# Altium project FOC_V1.1.PrjPCB
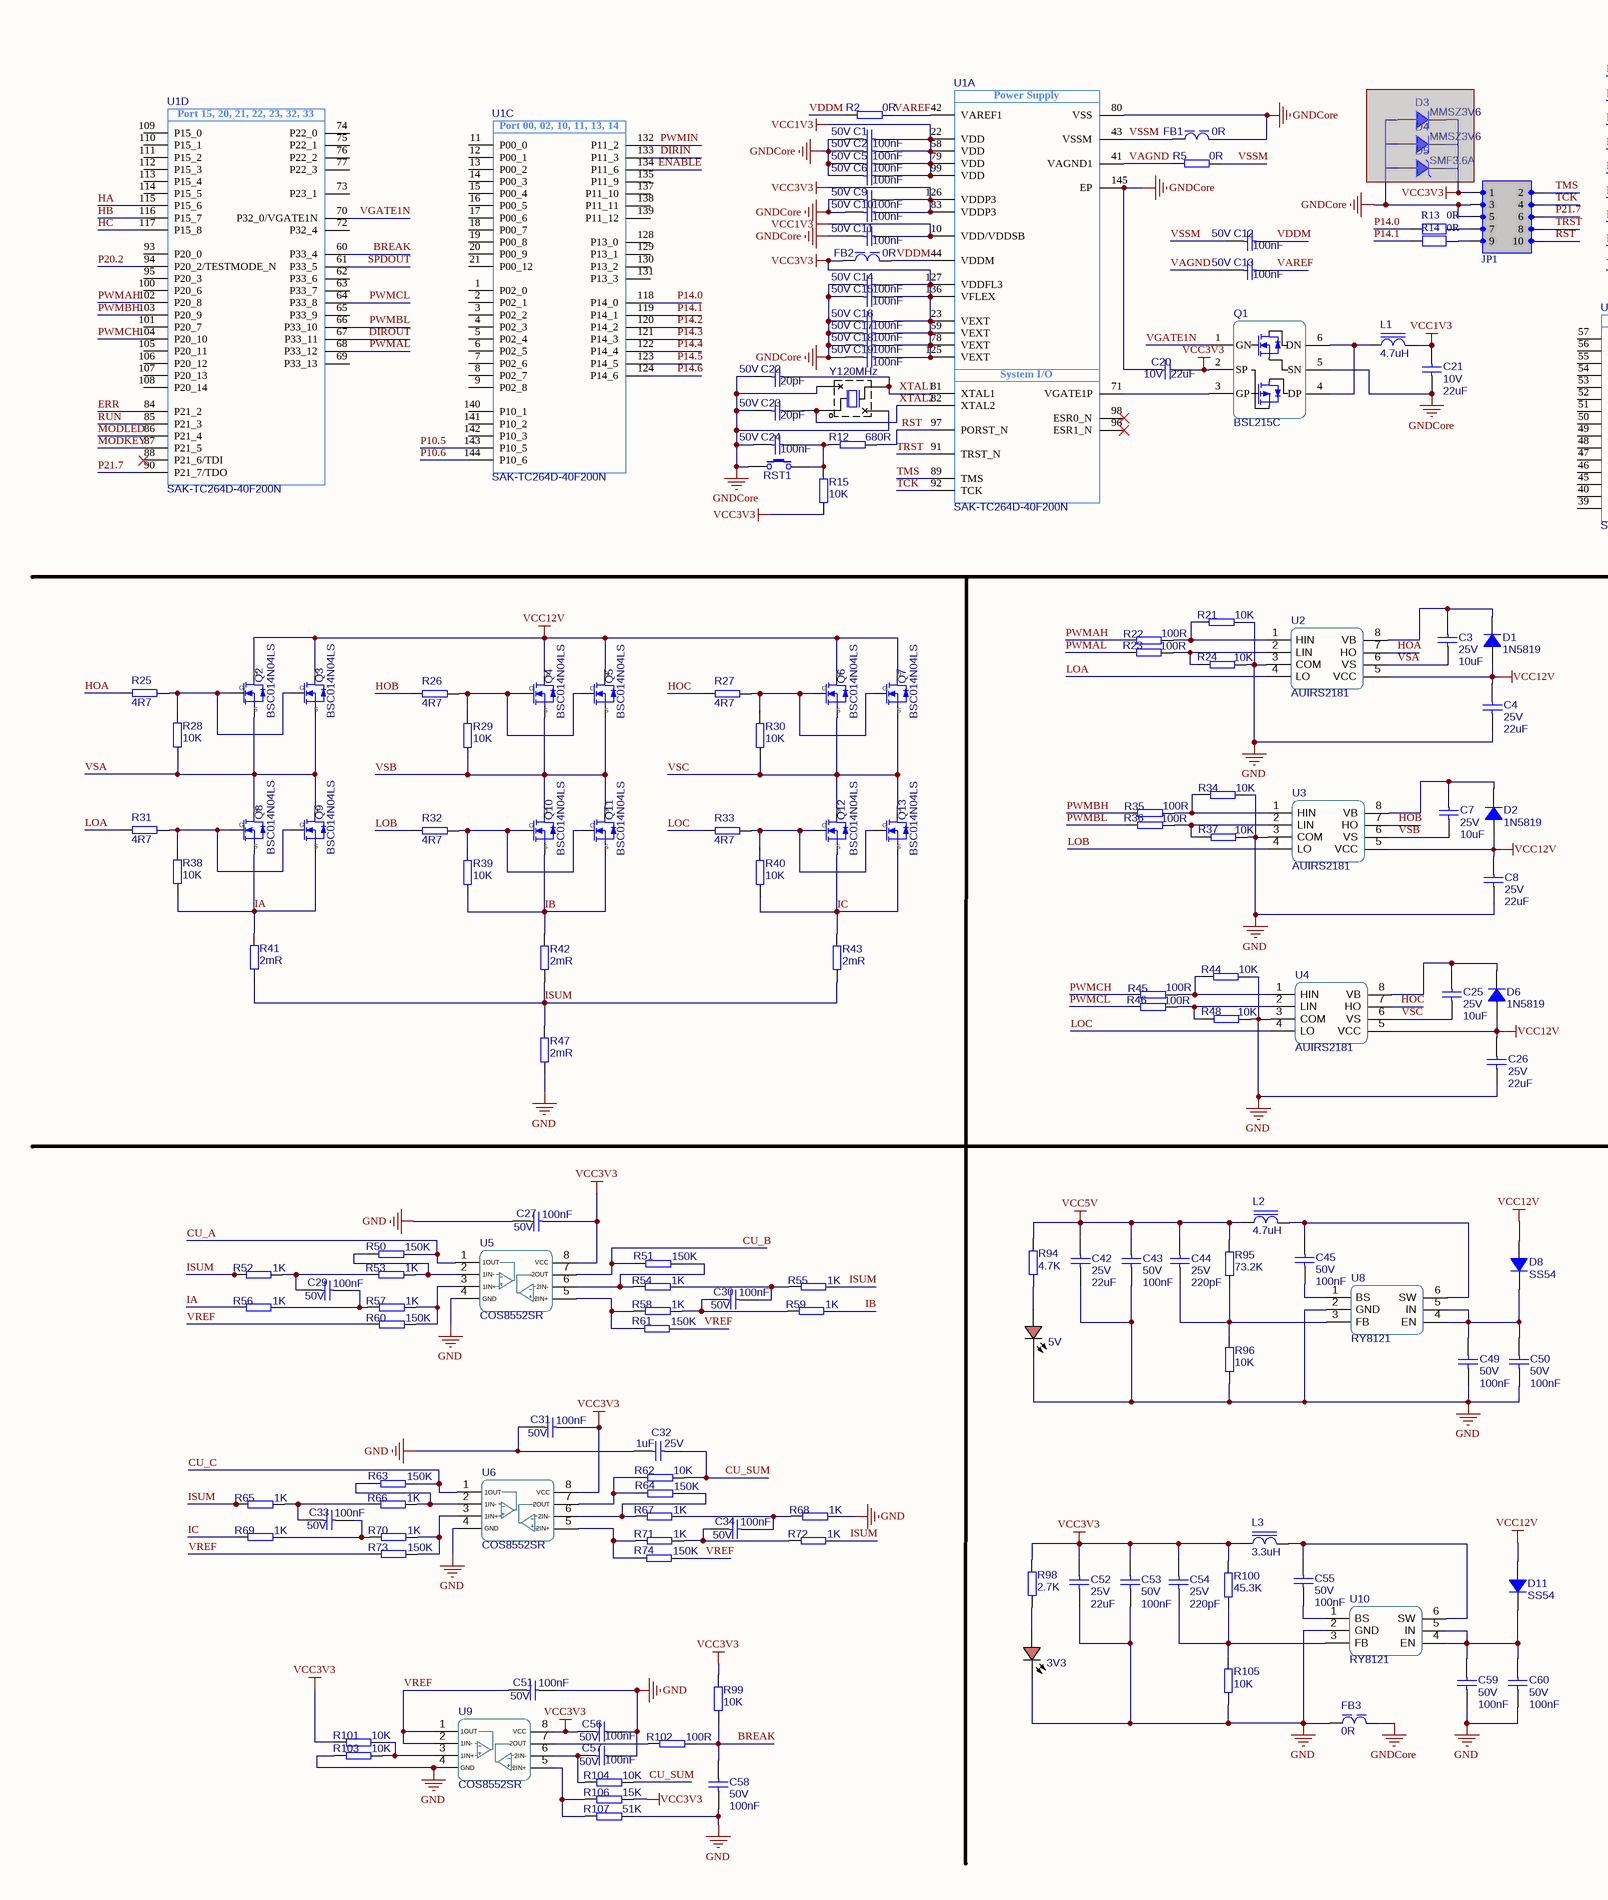
[diagram p0: Port.SchDoc, left]
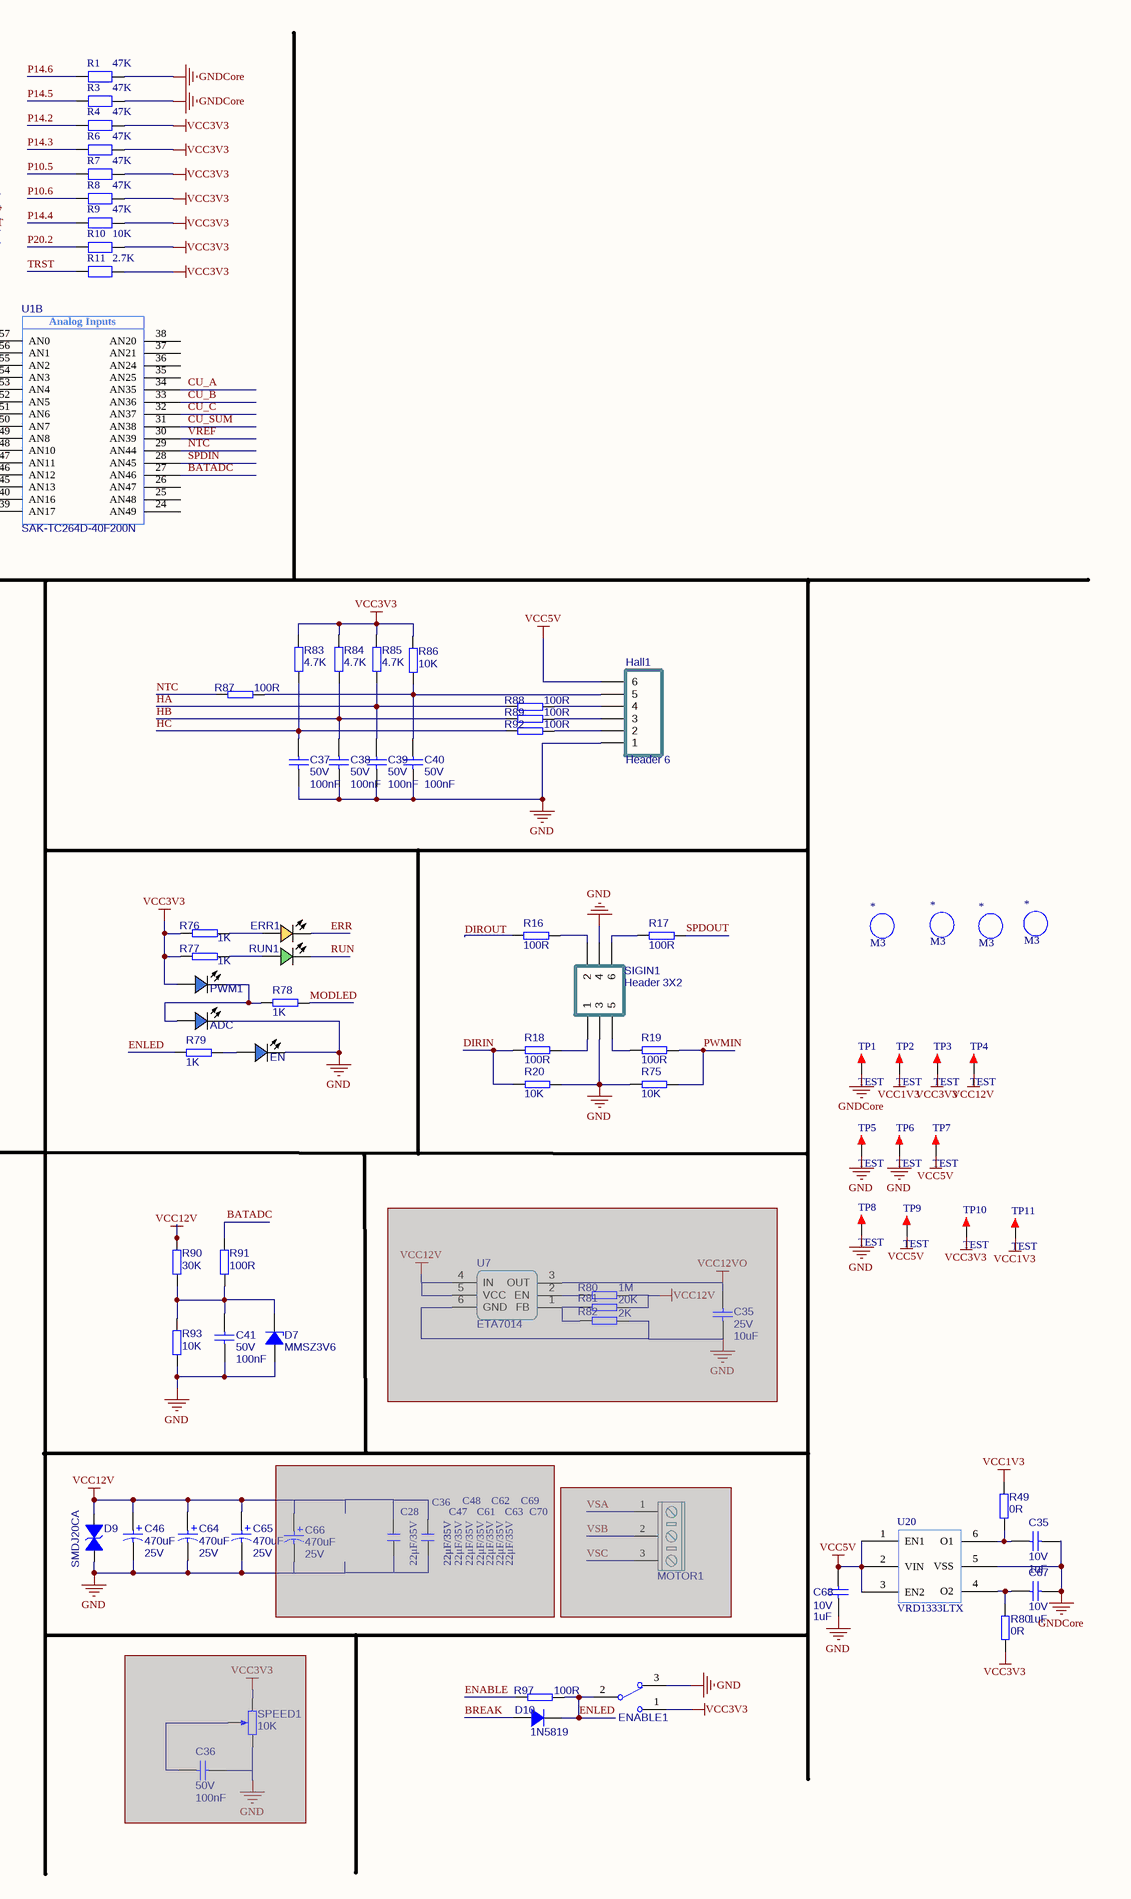
[diagram p1: Port.SchDoc, right]
1 sheet, 251 parts. Net scope: global (net labels, ports and power ports of the same name join across sheets).
Board files: FOC_V1.1.PcbDoc, INFILING.PcbDoc

## Sheet Port.SchDoc
size A2

### Parts
(Parts that share a designator on the sheet are numbered #1, #2 ... from top to bottom, then left to right.)
3V3  红色贴片LED  [LEDC1608(0603)-L]  (value not drawn)
5V  红色贴片LED  [LEDC1608(0603)-L]  (value not drawn)
*#1  M3  [M3 125X200]
*#2  M3  [M3 125X200]
*#3  M3  [M3 125X200]
*#4  M3  [M3 125X200]
ADC  蓝色贴片LED  [LEDC1608(0603)-L]  (value not drawn)
C1  value 100nF  Voltage: 50V  [CAPC1608[0603]S-N]  (hidden comment: 100nF ±10% 50V)
C2  value 100nF  Voltage: 50V  [CAPC1608[0603]S-N]  (hidden comment: 100nF ±10% 50V)
C3  value 10uF  Voltage: 25V  [CAPC1608[0603]S-N]  (hidden comment: 10uF ±10% 25V)
C4  value 22uF  Voltage: 25V  [CAPC1608[0603]S-N]  (hidden comment: 22uF ±10% 25V)
C5  value 100nF  Voltage: 50V  [CAPC1608[0603]S-N]  (hidden comment: 100nF ±10% 50V)
C6  value 100nF  Voltage: 50V  [CAPC1608[0603]S-N]  (hidden comment: 100nF ±10% 50V)
C7  value 10uF  Voltage: 25V  [CAPC1608[0603]S-N]  (hidden comment: 10uF ±10% 25V)
C8  value 22uF  Voltage: 25V  [CAPC1608[0603]S-N]  (hidden comment: 22uF ±10% 25V)
C9  value 100nF  Voltage: 50V  [CAPC1608[0603]S-N]  (hidden comment: 100nF ±10% 50V)
C10  value 100nF  Voltage: 50V  [CAPC1608[0603]S-N]  (hidden comment: 100nF ±10% 50V)
C11  value 100nF  Voltage: 50V  [CAPC1608[0603]S-N]  (hidden comment: 100nF ±10% 50V)
C12  value 100nF  Voltage: 50V  [CAPC1608[0603]S-N]  (hidden comment: 100nF ±10% 50V)
C13  value 100nF  Voltage: 50V  [CAPC1608[0603]S-N]  (hidden comment: 100nF ±10% 50V)
C14  value 100nF  Voltage: 50V  [CAPC1608[0603]S-N]  (hidden comment: 100nF ±10% 50V)
C15  value 100nF  Voltage: 50V  [CAPC1608[0603]S-N]  (hidden comment: 100nF ±10% 50V)
C16  value 100nF  Voltage: 50V  [CAPC1608[0603]S-N]  (hidden comment: 100nF ±10% 50V)
C17  value 100nF  Voltage: 50V  [CAPC1608[0603]S-N]  (hidden comment: 100nF ±10% 50V)
C18  value 100nF  Voltage: 50V  [CAPC1608[0603]S-N]  (hidden comment: 100nF ±10% 50V)
C19  value 100nF  Voltage: 50V  [CAPC1608[0603]S-N]  (hidden comment: 100nF ±10% 50V)
C20  value 22uF  Voltage: 10V  [CAPC1608[0603]S-N]  (hidden comment: 22uF ±10% 10V)
C21  value 22uF  Voltage: 10V  [CAPC1608[0603]S-N]  (hidden comment: 22uF ±10% 10V)
C22  value 20pF  Voltage: 50V  [CAPC1608[0603]S-N]  (hidden comment: 20pF ±10% 50V)
C23  value 20pF  Voltage: 50V  [CAPC1608[0603]S-N]  (hidden comment: 20pF ±10% 50V)
C24  value 100nF  Voltage: 50V  [CAPC1608[0603]S-N]  (hidden comment: 100nF ±10% 50V)
C25  value 10uF  Voltage: 25V  [CAPC1608[0603]S-N]  (hidden comment: 10uF ±10% 25V)
C26  value 22uF  Voltage: 25V  [CAPC1608[0603]S-N]  (hidden comment: 22uF ±10% 25V)
C27  value 100nF  Voltage: 50V  [CAPC1608[0603]S-N]  (hidden comment: 100nF ±10% 50V)
C28  22μF/35V  [C 1206_L]  (masked out: inside a compile mask, not in the netlist)
C29  value 100nF  Voltage: 50V  [CAPC1608[0603]S-N]  (hidden comment: 100nF ±10% 50V)
C30  value 100nF  Voltage: 50V  [CAPC1608[0603]S-N]  (hidden comment: 100nF ±10% 50V)
C31  value 100nF  Voltage: 50V  [CAPC1608[0603]S-N]  (hidden comment: 100nF ±10% 50V)
C32  value 1uF  Voltage: 25V  [CAPC1608[0603]S-N]  (hidden comment: 1uF ±10% 25V)
C33  value 100nF  Voltage: 50V  [CAPC1608[0603]S-N]  (hidden comment: 100nF ±10% 50V)
C34  value 100nF  Voltage: 50V  [CAPC1608[0603]S-N]  (hidden comment: 100nF ±10% 50V)
C35#1  value 10uF  Voltage: 25V  [CAPC1608[0603]S-N]  (hidden comment: 10uF ±10% 25V)  (masked out: inside a compile mask, not in the netlist)
C35#2  value 1uF  Voltage: 10V  [CAPC1608[0603]S-N]  (hidden comment: 1uF ±10% 10V)
C36#1  22μF/35V  [C 1206_L]  (masked out: inside a compile mask, not in the netlist)
C36#2  value 100nF  Voltage: 50V  [CAPC1608[0603]S-N]  (hidden comment: 100nF ±10% 50V)  (masked out: inside a compile mask, not in the netlist)
C37  value 100nF  Voltage: 50V  [CAPC1608[0603]S-N]  (hidden comment: 100nF ±10% 50V)
C38  value 100nF  Voltage: 50V  [CAPC1608[0603]S-N]  (hidden comment: 100nF ±10% 50V)
C39  value 100nF  Voltage: 50V  [CAPC1608[0603]S-N]  (hidden comment: 100nF ±10% 50V)
C40  value 100nF  Voltage: 50V  [CAPC1608[0603]S-N]  (hidden comment: 100nF ±10% 50V)
C41  value 100nF  Voltage: 50V  [CAPC1608[0603]S-N]  (hidden comment: 100nF ±10% 50V)
C42  value 22uF  Voltage: 25V  [CAPC1608[0603]S-N]  (hidden comment: 22uF ±10% 25V)
C43  value 100nF  Voltage: 50V  [CAPC1608[0603]S-N]  (hidden comment: 100nF ±10% 50V)
C44  value 220pF  Voltage: 25V  [CAPC1608[0603]S-N]  (hidden comment: 220pF ±10% 25V)
C45  value 100nF  Voltage: 50V  [CAPC1608[0603]S-N]  (hidden comment: 100nF ±10% 50V)
C46  value 470uF  Voltage: 25V  [CAPPR3.5-8X12]  (hidden comment: 470uF 25V)
C47  22μF/35V  [C 1206_L]  (masked out: inside a compile mask, not in the netlist)
C48  22μF/35V  [C 1206_L]  (masked out: inside a compile mask, not in the netlist)
C49  value 100nF  Voltage: 50V  [CAPC1608[0603]S-N]  (hidden comment: 100nF ±10% 50V)
C50  value 100nF  Voltage: 50V  [CAPC1608[0603]S-N]  (hidden comment: 100nF ±10% 50V)
C51  value 100nF  Voltage: 50V  [CAPC1608[0603]S-N]  (hidden comment: 100nF ±10% 50V)
C52  value 22uF  Voltage: 25V  [CAPC1608[0603]S-N]  (hidden comment: 22uF ±10% 25V)
C53  value 100nF  Voltage: 50V  [CAPC1608[0603]S-N]  (hidden comment: 100nF ±10% 50V)
C54  value 220pF  Voltage: 25V  [CAPC1608[0603]S-N]  (hidden comment: 220pF ±10% 25V)
C55  value 100nF  Voltage: 50V  [CAPC1608[0603]S-N]  (hidden comment: 100nF ±10% 50V)
C56  value 100nF  Voltage: 50V  [CAPC1608[0603]S-N]  (hidden comment: 100nF ±10% 50V)
C57  value 100nF  Voltage: 50V  [CAPC1608[0603]S-N]  (hidden comment: 100nF ±10% 50V)
C58  value 100nF  Voltage: 50V  [CAPC1608[0603]S-N]  (hidden comment: 100nF ±10% 50V)
C59  value 100nF  Voltage: 50V  [CAPC1608[0603]S-N]  (hidden comment: 100nF ±10% 50V)
C60  value 100nF  Voltage: 50V  [CAPC1608[0603]S-N]  (hidden comment: 100nF ±10% 50V)
C61  22μF/35V  [C 1206_L]  (masked out: inside a compile mask, not in the netlist)
C62  22μF/35V  [C 1206_L]  (masked out: inside a compile mask, not in the netlist)
C63  22μF/35V  [C 1206_L]  (masked out: inside a compile mask, not in the netlist)
C64  value 470uF  Voltage: 25V  [CAPPR3.5-8X12]  (hidden comment: 470uF 25V)
C65  value 470uF  Voltage: 25V  [CAPPR3.5-8X12]  (hidden comment: 470uF 25V)
C66  value 470uF  Voltage: 25V  [CM D(6.3*5.4)]  (hidden comment: 470uF 25V)  (masked out: inside a compile mask, not in the netlist)
C67  value 1uF  Voltage: 10V  [CAPC1608[0603]S-N]  (hidden comment: 1uF ±10% 10V)
C68  value 1uF  Voltage: 10V  [CAPC1608[0603]S-N]  (hidden comment: 1uF ±10% 10V)
C69  22μF/35V  [C 1206_L]  (masked out: inside a compile mask, not in the netlist)
C70  22μF/35V  [C 1206_L]  (masked out: inside a compile mask, not in the netlist)
D1  1N5819  [SOD-123-L]
D2  1N5819  [SOD-123-L]
D3  MMSZ3V6  [SOD-123-L]  (masked out: inside a compile mask, not in the netlist)
D4  MMSZ3V6  [SOD-123-L]  (masked out: inside a compile mask, not in the netlist)
D5  SMF3.6A  [SOD-123-L]  (masked out: inside a compile mask, not in the netlist)
D6  1N5819  [SOD-123-L]
D7  MMSZ3V6  [SOD-123-L]
D8  SS54  [SMA[DO-214AC]]
D9  SMDJ20CA  [SMC[DO-214AB]]
D10  1N5819  [SOD-123-L]
D11  SS54  [SMA[DO-214AC]]
EN  蓝色贴片LED  [LEDC1608(0603)-L]  (value not drawn)
ENABLE1  SW-SPDT  [MSK-12C01-07]  (value not drawn)
ERR1  黄色贴片LED  [LEDC1608(0603)-L]  (value not drawn)
FB1  value 0R  [CAPC1608[0603]S-N]  (hidden comment: 0R @100MHz 500mA)
FB2  value 0R  [CAPC1608[0603]S-N]  (hidden comment: 0R @100MHz 500mA)
FB3  value 0R  [INDC1005[0402]S]  (hidden comment: 0R @100MHz 500mA)
Hall1  Header 6  [ZH1.5-WF-6P]
JP1  Header 5X2  [DC3-10P]  (value not drawn)
L1  4.7uH  [SLO2520]
L2  4.7uH  [SLO2520]
L3  3.3uH  [SLO2520]
MOTOR1  KF/WJ/DG 30x connecter  [KF/WJ/DG 301-3p-5.0mm]  (value not drawn)  (masked out: inside a compile mask, not in the netlist)
PWM1  蓝色贴片LED  [LEDC1608(0603)-L]  (value not drawn)
Q1  BSL215C  [SOT-23-6]
Q2  BSC014N04LS  [TDSON-8]
Q3  BSC014N04LS  [TDSON-8]
Q4  BSC014N04LS  [TDSON-8]
Q5  BSC014N04LS  [TDSON-8]
Q6  BSC014N04LS  [TDSON-8]
Q7  BSC014N04LS  [TDSON-8]
Q8  BSC014N04LS  [TDSON-8]
Q9  BSC014N04LS  [TDSON-8]
Q10  BSC014N04LS  [TDSON-8]
Q11  BSC014N04LS  [TDSON-8]
Q12  BSC014N04LS  [TDSON-8]
Q13  BSC014N04LS  [TDSON-8]
R1  47K  [R 0603_L]
R2  value 0R  [RESC1608[0603]S-N]  (hidden comment: 0R ±1%)
R3  47K  [R 0603_L]
R4  47K  [R 0603_L]
R5  value 0R  [RESC1608[0603]S-N]  (hidden comment: 0R ±1%)
R6  47K  [R 0603_L]
R7  47K  [R 0603_L]
R8  47K  [R 0603_L]
R9  47K  [R 0603_L]
R10  10K  [R 0603_L]
R11  2.7K  [R 0603_L]
R12  value 680R  [RESC1608[0603]S-N]  (hidden comment: 680R ±1%)
R13  0R  [R 0603_L]
R14  0R  [R 0603_L]
R15  value 10K  [RESC1608[0603]S-N]  (hidden comment: 10K ±1%)
R16  value 100R  [RESC1608[0603]S-N]  (hidden comment: 100R ±1%)
R17  value 100R  [RESC1608[0603]S-N]  (hidden comment: 100R ±1%)
R18  value 100R  [RESC1608[0603]S-N]  (hidden comment: 100R ±1%)
R19  value 100R  [RESC1608[0603]S-N]  (hidden comment: 100R ±1%)
R20  value 10K  [RESC1608[0603]S-N]  (hidden comment: 10K ±1%)
R21  value 10K  [RESC1608[0603]S-N]  (hidden comment: 10K ±1%)
R22  value 100R  [RESC1608[0603]S-N]  (hidden comment: 100R ±1%)
R23  value 100R  [RESC1608[0603]S-N]  (hidden comment: 100R ±1%)
R24  value 10K  [RESC1608[0603]S-N]  (hidden comment: 10K ±1%)
R25  value 4R7  [RESC1608[0603]S-N]  (hidden comment: 4R7 ±1%)
R26  value 4R7  [RESC1608[0603]S-N]  (hidden comment: 4R7 ±1%)
R27  value 4R7  [RESC1608[0603]S-N]  (hidden comment: 4R7 ±1%)
R28  value 10K  [RESC1608[0603]S-N]  (hidden comment: 10K ±1%)
R29  value 10K  [RESC1608[0603]S-N]  (hidden comment: 10K ±1%)
R30  value 10K  [RESC1608[0603]S-N]  (hidden comment: 10K ±1%)
R31  value 4R7  [RESC1608[0603]S-N]  (hidden comment: 4R7 ±1%)
R32  value 4R7  [RESC1608[0603]S-N]  (hidden comment: 4R7 ±1%)
R33  value 4R7  [RESC1608[0603]S-N]  (hidden comment: 4R7 ±1%)
R34  value 10K  [RESC1608[0603]S-N]  (hidden comment: 10K ±1%)
R35  value 100R  [RESC1608[0603]S-N]  (hidden comment: 100R ±1%)
R36  value 100R  [RESC1608[0603]S-N]  (hidden comment: 100R ±1%)
R37  value 10K  [RESC1608[0603]S-N]  (hidden comment: 10K ±1%)
R38  value 10K  [RESC1608[0603]S-N]  (hidden comment: 10K ±1%)
R39  value 10K  [RESC1608[0603]S-N]  (hidden comment: 10K ±1%)
R40  value 10K  [RESC1608[0603]S-N]  (hidden comment: 10K ±1%)
R41  value 2mR  [RESC6332[2512]S]  (hidden comment: 2mR ±1%)
R42  value 2mR  [RESC6332[2512]S]  (hidden comment: 2mR ±1%)
R43  value 2mR  [RESC6332[2512]S]  (hidden comment: 2mR ±1%)
R44  value 10K  [RESC1608[0603]S-N]  (hidden comment: 10K ±1%)
R45  value 100R  [RESC1608[0603]S-N]  (hidden comment: 100R ±1%)
R46  value 100R  [RESC1608[0603]S-N]  (hidden comment: 100R ±1%)
R47  value 2mR  [RESC6332[2512]S]  (hidden comment: 2mR ±1%)
R48  value 10K  [RESC1608[0603]S-N]  (hidden comment: 10K ±1%)
R49  value 0R  [RESC1608[0603]S-N]  (hidden comment: 0R ±1%)
R50  value 150K  [RESC1608[0603]S-N]  (hidden comment: 150K ±1%)
R51  value 150K  [RESC1608[0603]S-N]  (hidden comment: 150K ±1%)
R52  value 1K  [RESC1608[0603]S-N]  (hidden comment: 1K ±1%)
R53  value 1K  [RESC1608[0603]S-N]  (hidden comment: 1K ±1%)
R54  value 1K  [RESC1608[0603]S-N]  (hidden comment: 1K ±1%)
R55  value 1K  [RESC1608[0603]S-N]  (hidden comment: 1K ±1%)
R56  value 1K  [RESC1608[0603]S-N]  (hidden comment: 1K ±1%)
R57  value 1K  [RESC1608[0603]S-N]  (hidden comment: 1K ±1%)
R58  value 1K  [RESC1608[0603]S-N]  (hidden comment: 1K ±1%)
R59  value 1K  [RESC1608[0603]S-N]  (hidden comment: 1K ±1%)
R60  value 150K  [RESC1608[0603]S-N]  (hidden comment: 150K ±1%)
R61  value 150K  [RESC1608[0603]S-N]  (hidden comment: 150K ±1%)
R62  value 10K  [RESC1608[0603]S-N]  (hidden comment: 10K ±1%)
R63  value 150K  [RESC1608[0603]S-N]  (hidden comment: 150K ±1%)
R64  value 150K  [RESC1608[0603]S-N]  (hidden comment: 150K ±1%)
R65  value 1K  [RESC1608[0603]S-N]  (hidden comment: 1K ±1%)
R66  value 1K  [RESC1608[0603]S-N]  (hidden comment: 1K ±1%)
R67  value 1K  [RESC1608[0603]S-N]  (hidden comment: 1K ±1%)
R68  value 1K  [RESC1608[0603]S-N]  (hidden comment: 1K ±1%)
R69  value 1K  [RESC1608[0603]S-N]  (hidden comment: 1K ±1%)
R70  value 1K  [RESC1608[0603]S-N]  (hidden comment: 1K ±1%)
R71  value 1K  [RESC1608[0603]S-N]  (hidden comment: 1K ±1%)
R72  value 1K  [RESC1608[0603]S-N]  (hidden comment: 1K ±1%)
R73  value 150K  [RESC1608[0603]S-N]  (hidden comment: 150K ±1%)
R74  value 150K  [RESC1608[0603]S-N]  (hidden comment: 150K ±1%)
R75  value 10K  [RESC1608[0603]S-N]  (hidden comment: 10K ±1%)
R76  value 1K  [RESC1608[0603]S-N]  (hidden comment: 1K ±1%)
R77  value 1K  [RESC1608[0603]S-N]  (hidden comment: 1K ±1%)
R78  value 1K  [RESC1608[0603]S-N]  (hidden comment: 1K ±1%)
R79  value 1K  [RESC1608[0603]S-N]  (hidden comment: 1K ±1%)
R80#1  value 1M  [RESC1608[0603]S-N]  (hidden comment: 1M ±1%)  (masked out: inside a compile mask, not in the netlist)
R80#2  value 0R  [RESC1608[0603]S-N]  (hidden comment: 0R ±1%)
R81  value 20K  [RESC1608[0603]S-N]  (hidden comment: 20K ±1%)  (masked out: inside a compile mask, not in the netlist)
R82  value 2K  [RESC1608[0603]S-N]  (hidden comment: 2K ±1%)  (masked out: inside a compile mask, not in the netlist)
R83  value 4.7K  [RESC1608[0603]S-N]  (hidden comment: 4.7K ±1%)
R84  value 4.7K  [RESC1608[0603]S-N]  (hidden comment: 4.7K ±1%)
R85  value 4.7K  [RESC1608[0603]S-N]  (hidden comment: 4.7K ±1%)
R86  value 10K  [RESC1608[0603]S-N]  (hidden comment: 10K ±1%)
R87  value 100R  [RESC1608[0603]S-N]  (hidden comment: 100R ±1%)
R88  value 100R  [RESC1608[0603]S-N]  (hidden comment: 100R ±1%)
R89  value 100R  [RESC1608[0603]S-N]  (hidden comment: 100R ±1%)
R90  value 30K  [RESC1608[0603]S-N]  (hidden comment: 30K ±1%)
R91  value 100R  [RESC1608[0603]S-N]  (hidden comment: 100R ±1%)
R92  value 100R  [RESC1608[0603]S-N]  (hidden comment: 100R ±1%)
R93  value 10K  [RESC1608[0603]S-N]  (hidden comment: 10K ±1%)
R94  value 4.7K  [RESC1608[0603]S-N]  (hidden comment: 4.7K ±1%)
R95  value 73.2K  [RESC1608[0603]S-N]  (hidden comment: 73.2K ±1%)
R96  value 10K  [RESC1608[0603]S-N]  (hidden comment: 10K ±1%)
R97  value 100R  [RESC1608[0603]S-N]  (hidden comment: 100R ±1%)
R98  value 2.7K  [RESC1608[0603]S-N]  (hidden comment: 2.7K ±1%)
R99  value 10K  [RESC1608[0603]S-N]  (hidden comment: 10K ±1%)
R100  value 45.3K  [RESC1608[0603]S-N]  (hidden comment: 45.3K ±1%)
R101  value 10K  [RESC1608[0603]S-N]  (hidden comment: 10K ±1%)
R102  value 100R  [RESC1608[0603]S-N]  (hidden comment: 100R ±1%)
R103  value 10K  [RESC1608[0603]S-N]  (hidden comment: 10K ±1%)
R104  value 10K  [RESC1608[0603]S-N]  (hidden comment: 10K ±1%)
R105  value 10K  [RESC1608[0603]S-N]  (hidden comment: 10K ±1%)
R106  value 15K  [RESC1608[0603]S-N]  (hidden comment: 15K ±1%)
R107  value 51K  [RESC1608[0603]S-N]  (hidden comment: 51K ±1%)
RST1  Button  [PTS810-3*4-CurvePin]  (value not drawn)
RUN1  翠绿贴片LED  [LEDC1608(0603)-L]  (value not drawn)
SIGIN1  Header 3X2  [ZH1.5-WF-6P]
SPEED1  10K  [RESPOT3386P]  (masked out: inside a compile mask, not in the netlist)
TP1  TEST  [TEST 0.8]
TP2  TEST  [TEST 0.8]
TP3  TEST  [TEST 0.8]
TP4  TEST  [TEST 0.8]
TP5  TEST  [TEST 0.8]
TP6  TEST  [TEST 0.8]
TP7  TEST  [TEST 0.8]
TP8  TEST  [TEST 2.0]
TP9  TEST  [TEST 2.0]
TP10  TEST  [TEST 2.0]
TP11  TEST  [TEST 2.0]
U1  SAK-TC264D-40F200N  [LQFP144_L_E]  (parts A,B,C,D of 4)
U2  AUIRS2181  [SOP-8]
U3  AUIRS2181  [SOP-8]
U4  AUIRS2181  [SOP-8]
U5  COS8552SR  [SOP-8]
U6  COS8552SR  [SOP-8]
U7  ETA7014  [SOT-23-6]  (masked out: inside a compile mask, not in the netlist)
U8  RY8121  [SOT-23-6]
U9  COS8552SR  [SOP-8]
U10  RY8121  [SOT-23-6]
U20  VRD1333LTX  [SOT-23-6]
Y1  20MHz  [X3225-4]

### Nets
GND: 3V3.C 5V.C ADC.C C4.1 C8.1 C26.1 C27.1 C31.1 C32.1 C37.1 C38.1 C39.1 C40.1 C41.1 C42.1 C43.1 C46.2 C49.1 C50.1 C51.2 C52.1 C53.1 C56.2 C57.2 C58.1 C59.1 C60.1 C64.2 C65.2 C68.1 D7.A D9.A EN.C ENABLE1.3 FB3.1 Hall1.1 R20.2 R21.2 R24.2 R34.2 R37.2 R44.2 R47.1 R48.2 R68.2 R75.1 R93.2 R96.1 R103.1 R105.1 R107.2 SIGIN1.3 SIGIN1.4 TP5.1 TP6.1 TP8.1 U2.3(COM) U3.3(COM) U4.3(COM) U5.4(GND) U6.4(GND) U8.2(GND) U9.4(GND) U10.2(GND)
GNDCore: C1.1 C2.1 C5.1 C6.1 C9.1 C10.1 C11.1 C14.1 C15.1 C16.1 C17.1 C18.1 C19.1 C20.1 C21.1 C22.1 C23.1 C24.1 C35#2.2 C67.2 FB1.2 FB3.2 JP1.3 JP1.5 Q1.5(SN) R1.2 R3.2 RST1.2 TP1.1 U1.80(VSS) U1.145(EP) U20.5(VSS) Y1.2(NC) Y1.4(NC)
VCC1V3: C1.2 C2.2 C5.2 C6.2 C11.2 C21.2 L1.2 R49.1 TP2.1 TP11.1 U1.10(VDD/VDDSB) U1.22(VDD) U1.58(VDD) U1.79(VDD) U1.99(VDD)
VCC3V3: C9.2 C10.2 C14.2 C15.2 C16.2 C17.2 C18.2 C19.2 C20.2 C27.2 C31.2 C52.2 C53.2 C54.2 C56.1 ENABLE1.1 FB2.1 JP1.1 L3.1 PWM1.A Q1.2(SP) R4.2 R6.2 R7.2 R8.2 R9.2 R10.2 R11.2 R15.1 R76.2 R77.2 R80#2.2 R83.2 R84.2 R85.2 R86.2 R98.2 R99.2 R100.2 R101.1 R106.2 TP3.1 TP10.1 U1.23(VEXT) U1.59(VEXT) U1.78(VEXT) U1.83(VDDP3) U1.125(VEXT) U1.126(VDDP3) U1.127(VDDFL3) U1.136(VFLEX) U5.8(VCC) U6.8(VCC) U9.8(VCC)
VCC5V: C42.2 C43.2 C44.2 C68.2 Hall1.6 L2.1 R94.2 R95.2 TP7.1 TP9.1 U20.1(EN1) U20.2(VIN) U20.3(EN2)
VCC12V: C4.2 C8.2 C26.2 C46.1 C64.1 C65.1 D1.A D2.A D6.A D8.A D9.K D11.A Q2.1(D) Q3.1(D) Q4.1(D) Q5.1(D) Q6.1(D) Q7.1(D) R90.1 TP4.1 U2.5(VCC) U3.5(VCC) U4.5(VCC)
BATADC: R91.1 U1.27(AN46)
BREAK: C58.2 D10.A R99.1 R102.2 U1.60(P33_4)
CU_A: R50.2 U1.34(AN35) U5.1(1OUT)
CU_B: R51.1 U1.33(AN36) U5.7(2OUT)
CU_C: R63.2 U1.32(AN37) U6.1(1OUT)
CU_SUM: C32.2 R62.2 R104.2 U1.31(AN38)
DIRIN: R18.1 R20.1 U1.133(P11_3)
DIROUT: R16.1 U1.67(P33_11)
ENABLE: R97.1 U1.134(P11_6)
ENLED: D10.K ENABLE1.2 R79.2 R97.2
ERR: ERR1.C U1.84(P21_2)
HA: C39.2 R85.1 R88.1 U1.115(P15_6)
HB: C38.2 R84.1 R89.1 U1.116(P15_7)
HC: C37.2 R83.1 R92.1 U1.117(P15_8)
HOA: R25.1 U2.7(HO)
HOB: R26.1 U3.7(HO)
HOC: R27.1 U4.7(HO)
IA: Q8.3(S) Q9.3(S) R38.1 R41.2 R56.1
IB: Q10.3(S) Q11.3(S) R39.1 R42.2 R59.2
IC: Q12.3(S) Q13.3(S) R40.1 R43.2 R69.1
ISUM: R41.1 R42.1 R43.1 R47.2 R52.1 R55.2 R65.1 R72.2
LOA: R31.1 U2.4(LO)
LOB: R32.1 U3.4(LO)
LOC: R33.1 U4.4(LO)
MODKEY: U1.87(P21_5)
MODLED: R78.1 U1.86(P21_4)
NTC: R87.1 U1.29(AN44)
P10.5: R7.1 U1.143(P10_5)
P10.6: R8.1 U1.144(P10_6)
P14.0: R13.1 U1.118(P14_0)
P14.1: R14.1 U1.119(P14_1)
P14.2: R4.1 U1.120(P14_2)
P14.3: R6.1 U1.121(P14_3)
P14.4: R9.1 U1.122(P14_4)
P14.5: R3.1 U1.123(P14_5)
P14.6: R1.1 U1.124(P14_6)
P20.2: R10.1 U1.94(P20_2/TESTMODE_N)
P21.7: JP1.6 U1.90(P21_7/TDO)
PWMAH: R22.1 U1.102(P20_8)
PWMAL: R23.1 U1.68(P33_12)
PWMBH: R35.1 U1.103(P20_9)
PWMBL: R36.1 U1.66(P33_10)
PWMCH: R45.1 U1.104(P20_10)
PWMCL: R46.1 U1.64(P33_8)
PWMIN: R19.2 R75.2 U1.132(P11_2)
RST: JP1.10 R12.2 U1.97(PORST_N)
RUN: RUN1.C U1.85(P21_3)
SPDIN: U1.28(AN45)
SPDOUT: R17.2 U1.61(P33_5)
TCK: JP1.4 U1.92(TCK)
TMS: JP1.2 U1.89(TMS)
TRST: JP1.8 R11.1 U1.91(TRST_N)
VAGND: C13.1 R5.1 U1.41(VAGND1)
VAREF: C13.2 R2.2 U1.42(VAREF1)
VDDM: C12.2 FB2.2 R2.1 U1.44(VDDM)
VGATE1N: Q1.1(GN) U1.70(P32_0/VGATE1N)
VREF: C51.1 R60.1 R61.2 R73.1 R74.2 U1.30(AN39) U9.1(1OUT) U9.2(1IN-)
VSA: C3.1 Q2.3(S) Q3.3(S) Q8.1(D) Q9.1(D) R28.1 U2.6(VS)
VSB: C7.1 Q4.3(S) Q5.3(S) Q10.1(D) Q11.1(D) R29.1 U3.6(VS)
VSC: C25.1 Q6.3(S) Q7.3(S) Q12.1(D) Q13.1(D) R30.1 U4.6(VS)
VSSM: C12.1 FB1.1 R5.2 U1.43(VSSM)
XTAL1: C22.2 U1.81(XTAL1) Y1.3(OSC2)
XTAL2: C23.2 U1.82(XTAL2) Y1.1(OSC1)
Net3V3_A: 3V3.A R98.1
Net5V_A: 5V.A R94.1
NetADC_A: ADC.A PWM1.C R78.2
NetC3_2: C3.2 D1.K U2.8(VB)
NetC7_2: C7.2 D2.K U3.8(VB)
NetC24_2: C24.2 R12.1 R15.2 RST1.1
NetC25_2: C25.2 D6.K U4.8(VB)
NetC29_1: C29.1 R52.2 R53.1
NetC29_2: C29.2 R56.2 R57.1
NetC30_1: C30.1 R58.2 R59.1
NetC30_2: C30.2 R54.2 R55.1
NetC33_1: C33.1 R65.2 R66.1
NetC33_2: C33.2 R69.2 R70.1
NetC34_1: C34.1 R71.2 R72.1
NetC34_2: C34.2 R67.2 R68.1
NetC35#2_1: C35#2.1 R49.2 U20.6(O1)
NetC40_2: C40.2 Hall1.5 R86.1 R87.2
NetC41_2: C41.2 D7.K R90.2 R91.2 R93.1
NetC44_1: C44.1 R95.1 R96.2 U8.3(FB)
NetC45_1: C45.1 U8.1(BS)
NetC45_2: C45.2 L2.2 U8.6(SW)
NetC49_2: C49.2 C50.2 D8.K U8.4(EN) U8.5(IN)
NetC54_1: C54.1 R100.1 R105.2 U10.3(FB)
NetC55_1: C55.1 U10.1(BS)
NetC55_2: C55.2 L3.2 U10.6(SW)
NetC57_1: C57.1 R104.1 U9.6(2IN-)
NetC59_2: C59.2 C60.2 D11.K U10.4(EN) U10.5(IN)
NetC67_1: C67.1 R80#2.1 U20.4(O2)
NetEN_A: EN.A R79.1
NetERR1_A: ERR1.A R76.1
NetHall1_2: Hall1.2 R92.2
NetHall1_3: Hall1.3 R89.2
NetHall1_4: Hall1.4 R88.2
NetJP1_7: JP1.7 R13.2
NetJP1_9: JP1.9 R14.2
NetL1_1: L1.1 Q1.4(DP) Q1.6(DN)
NetQ1_3: Q1.3(GP) U1.71(VGATE1P)
NetQ2_2: Q2.2(G) Q3.2(G) R25.2 R28.2
NetQ4_2: Q4.2(G) Q5.2(G) R26.2 R29.2
NetQ6_2: Q6.2(G) Q7.2(G) R27.2 R30.2
NetQ8_2: Q8.2(G) Q9.2(G) R31.2 R38.2
NetQ10_2: Q10.2(G) Q11.2(G) R32.2 R39.2
NetQ12_2: Q12.2(G) Q13.2(G) R33.2 R40.2
NetR16_2: R16.2 SIGIN1.2
NetR17_1: R17.1 SIGIN1.6
NetR18_2: R18.2 SIGIN1.1
NetR19_1: R19.1 SIGIN1.5
NetR21_1: R21.1 R22.2 U2.1(HIN)
NetR23_2: R23.2 R24.1 U2.2(LIN)
NetR34_1: R34.1 R35.2 U3.1(HIN)
NetR36_2: R36.2 R37.1 U3.2(LIN)
NetR44_1: R44.1 R45.2 U4.1(HIN)
NetR46_2: R46.2 R48.1 U4.2(LIN)
NetR50_1: R50.1 R53.2 U5.2(1IN-)
NetR51_2: R51.2 R54.1 U5.6(2IN-)
NetR57_2: R57.2 R60.2 U5.3(1IN+)
NetR58_1: R58.1 R61.1 U5.5(2IN+)
NetR62_1: R62.1 R64.1 U6.7(2OUT)
NetR63_1: R63.1 R66.2 U6.2(1IN-)
NetR64_2: R64.2 R67.1 U6.6(2IN-)
NetR70_2: R70.2 R73.2 U6.3(1IN+)
NetR71_1: R71.1 R74.1 U6.5(2IN+)
NetR77_1: R77.1 RUN1.A
NetR101_2: R101.2 R103.2 U9.3(1IN+)
NetR102_1: R102.1 U9.7(2OUT)
NetR106_1: R106.1 R107.1 U9.5(2IN+)

Not connected (* = marked no-connect by the designer): U1 1(P02_0) 2(P02_1) 3(P02_2) 4(P02_3) 5(P02_4) 6(P02_5) 7(P02_6) 8(P02_7) 9(P02_8) 11(P00_0) 12(P00_1) 13(P00_2) 14(P00_3) 15(P00_4) 16(P00_5) 17(P00_6) 18(P00_7) 19(P00_8) 20(P00_9) 21(P00_12) 24(AN49) 25(AN48) 26(AN47) 35(AN25) 36(AN24) 37(AN21) 38(AN20) 39(AN17) 40(AN16) 45(AN13) 46(AN12) 47(AN11) 48(AN10) 49(AN8) 50(AN7) 51(AN6) 52(AN5) 53(AN4) 54(AN3) 55(AN2) 56(AN1) 57(AN0) 62(P33_6) 63(P33_7) 65(P33_9) 69(P33_13) 72(P32_4) 73(P23_1) 74(P22_0) 75(P22_1) 76(P22_2) 77(P22_3) 88(P21_6/TDI)* 93(P20_0) 95(P20_3) 96(ESR1_N)* 98(ESR0_N)* 100(P20_6) 101(P20_7) 105(P20_11) 106(P20_12) 107(P20_13) 108(P20_14) 109(P15_0) 110(P15_1) 111(P15_2) 112(P15_3) 113(P15_4) 114(P15_5) 128(P13_0) 129(P13_1) 130(P13_2) 131(P13_3) 135(P11_9) 137(P11_10) 138(P11_11) 139(P11_12) 140(P10_1) 141(P10_2) 142(P10_3)

### Notes on the sheet
- (in symbol SAK-TC264D-40F200N, part A) Power Supply; System I/O
- (in symbol SAK-TC264D-40F200N, part B) Analog Inputs
- (in symbol SAK-TC264D-40F200N, part C) Port 00, 02, 10, 11, 13, 14
- (in symbol SAK-TC264D-40F200N, part D) Port 15, 20, 21, 22, 23, 32, 33

### Library data of the parts
3V3 5V = LED Chip Red: Published: 8-Jun-2000; Revision: July-2002: Re-released for DXP Platform.; Publisher: Altium Limited; Price(RMB): 0.00
*#1-*#4 = M3: 铜柱孔; 版权归属: 源创客; BOM名称: 铜柱孔; 学习资源: www.ooocke.com
ADC EN PWM1 = LED Chip Blue: Published: 8-Jun-2000; Revision: July-2002: Re-released for DXP Platform.; Publisher: Altium Limited; Price(RMB): 0.00; Color: Blue
C1 C2 C5 C6 C9-C24 C27 C29-C31 C33 C34 C36#2 C37-C41 C43 C45 C49-C51 C53 C55-C60 = Cap-Chip: 贴片电容; Published: 2020-12-18; Revision: V1.1; Tolerance: ±10%
C3 C7 C25 = Cap-Chip_3: 贴片电容; Published: 2020-12-18; Revision: V1.1; Tolerance: ±10%
C4 C8 C26 C35#1 C35#2 C42 C44 C52 C54 C67 C68 = Cap-Chip_1: 贴片电容; Published: 2020-12-18; Revision: V1.1; Tolerance: ±10%
C28 C36#1 C47 C48 C61-C63 C69 C70 = C: 无极性贴片电容; 版权归属: 源创客; BOM名称: 无极性贴片电容; 学习资源: www.ooocke.com
C32 = Cap-Chip_4: 贴片电容; Published: 2020-12-18; Revision: V1.1; Tolerance: ±10%
C46 C64-C66 = Cap-Elect: Polarized Capacitor (Radial); Published: 8-Jun-2000; Revision: July-2002: Re-released for DXP Platform.; Publisher: Altium Limited; Price(RMB): 0.000
D1 D2 D6 D10 = Diode: 普通二极管 Diode; Imax: 500mA; Published: 8-Jun-2000; Revision: July-2002: Re-released for DXP Platform.; Publisher: Altium Limited; Price(RMB): 0.000
D3 D4 D7 = Diode Zen: 稳压二极管 齐纳二极管  Zener Diode; Published: 8-Jun-2000; Revision: July-2002: Re-released for DXP Platform.; Publisher: Altium Limited; Price(RMB): 0.000
D5 = Diode TVS Uni-Dir: TRANSIENT VOLTAGE  SUPPRESSOR DIODE; Imax: 500mA; Published: 8-Jun-2000; Publisher: Altium Limited; Price(RMB): 0.000
D8 D11 = Diode_1: 普通二极管 Diode; Imax: 500mA; Published: 8-Jun-2000; Revision: July-2002: Re-released for DXP Platform.; Publisher: Altium Limited; Price(RMB): 0.000
D9 = Diode TVS Bi-Dir: TRANSIENT VOLTAGE  SUPPRESSOR DIODE; Imax: 500mA; Published: 8-Jun-2000; Publisher: Altium Limited; Price(RMB): 0.000
ENABLE1 = SW-SPDT: 单刀双掷开关 3脚船型、钮子、拨动开关 SPDT Subminiature Toggle Switch; Published: 24-Mar-1999; Publisher: Altium Limited; Price(RMB): 0.000
ERR1 = LED Chip Yellow: Published: 8-Jun-2000; Revision: July-2002: Re-released for DXP Platform.; Publisher: Altium Limited; Price(RMB): 0.00
FB1-FB3 = FB-Chip: 贴片磁珠; DCR: .1m; Published: 2020-12-18; Revision: V1.0; Frequency: @100MHz; Imax: 500mA
Hall1 = Header 6: Header, 6-Pin; LatestRevisionDate: 17-Jul-2002; LatestRevisionNote: Re-released for DXP Platform.; Publisher: Altium Limited; Price(RMB): 0.00
JP1 = Header 5X2: 5*2P接插件; 版权归属: 源创客; BOM名称: 5*2P接插件; 学习资源: www.ooocke.com
L1-L3 = Ind-Power: Power Inductor, Ferrite-Core; Imax: 50mA; DCR: .5m; Published: 8-Jun-2000; Revision: July-2002: Re-released for DXP Platform.; Publisher: Altium Limited; Price(RMB): 0.000
  L1 L2: Value: 4.7uH
  L3: Value: 3.3uH
MOTOR1 = KF/WJ/DG 30x-3P: 接线端子 3Pin
Q1 = BSL215C: BSL215C N+P
Q2-Q13 = BSC014N04LS: 英飞凌 N沟 MOS
R1 R3 R4 R6-R11 R13 R14 = R: 贴片电阻; 版权归属: 源创客; BOM名称: 贴片电阻; 学习资源: www.ooocke.com
R2 R5 R12 R15 = Res-Chip: 贴片电阻; Published: 8-Jun-2000; Revision: July-2002: Re-released for DXP Platform.; Tolerance: ±1%
R16-R20 R25-R27 R31-R33 R75 R80#1 R81 R82 R90 R91 R93 R95 R96 R100 R105 = Res-Chip_18: 贴片电阻; Published: 8-Jun-2000; Revision: July-2002: Re-released for DXP Platform.; Tolerance: ±1%
R21 R24 R28-R30 R34 R37-R40 R44 R48 R49 R62 R76-R79 R80#2 R83-R86 R101 R103 R104 R106 R107 = Res-Chip_2: 贴片电阻; Published: 8-Jun-2000; Revision: July-2002: Re-released for DXP Platform.; Tolerance: ±1%
R22 R23 R35 R36 R45 R46 = Res-Chip_4: 贴片电阻; Published: 8-Jun-2000; Revision: July-2002: Re-released for DXP Platform.; Tolerance: ±1%
R41-R43 R47 = Res-Chip_19: 贴片电阻; Published: 8-Jun-2000; Revision: July-2002: Re-released for DXP Platform.; Tolerance: ±1%
R50 R51 R61 R63 R64 R74 = Res-Chip_13: 贴片电阻; Published: 8-Jun-2000; Revision: July-2002: Re-released for DXP Platform.; Tolerance: ±1%
R52-R60 R65-R73 R87-R89 R92 R94 R97-R99 R102 = Res-Chip_7: 贴片电阻; Published: 8-Jun-2000; Revision: July-2002: Re-released for DXP Platform.; Tolerance: ±1%
RST1 = KEY: 按键; Published: 24-Mar-1999; Publisher: Altium Limited; Price(RMB): 0.000
RUN1 = LED Chip Green: Published: 8-Jun-2000; Revision: July-2002: Re-released for DXP Platform.; Publisher: Altium Limited; Price(RMB): 0.00
SIGIN1 = Header 3X2: Header, 3-Pin, Dual row; LatestRevisionDate: 17-Jul-2002; LatestRevisionNote: Re-released for DXP Platform.; Publisher: Altium Limited; Price(RMB): 0.00
SPEED1 = Res-Adj-3p: 可调电阻; Value: 10K
TP1-TP11 = TEST: 测试点; 版权归属: 源创客; BOM名称: 测试点; 学习资源: www.ooocke.com
U5 U6 U9 = COS8552SR: COS8552SR 二路通用运算放大器
U7 = ETA7014: ETA7014 OVP芯片
U8 U10 = RY8121: 18V 2A 1MHz Synchronous Step-Down Regulator
Y1 = XTAL-4: 四脚无源晶振 Crystal Oscillator; Value: 12MHz; Published: 8-Jun-2000; Revision: July-2002: Re-released for DXP Platform.; Publisher: Altium Limited; Price(RMB): 0.000